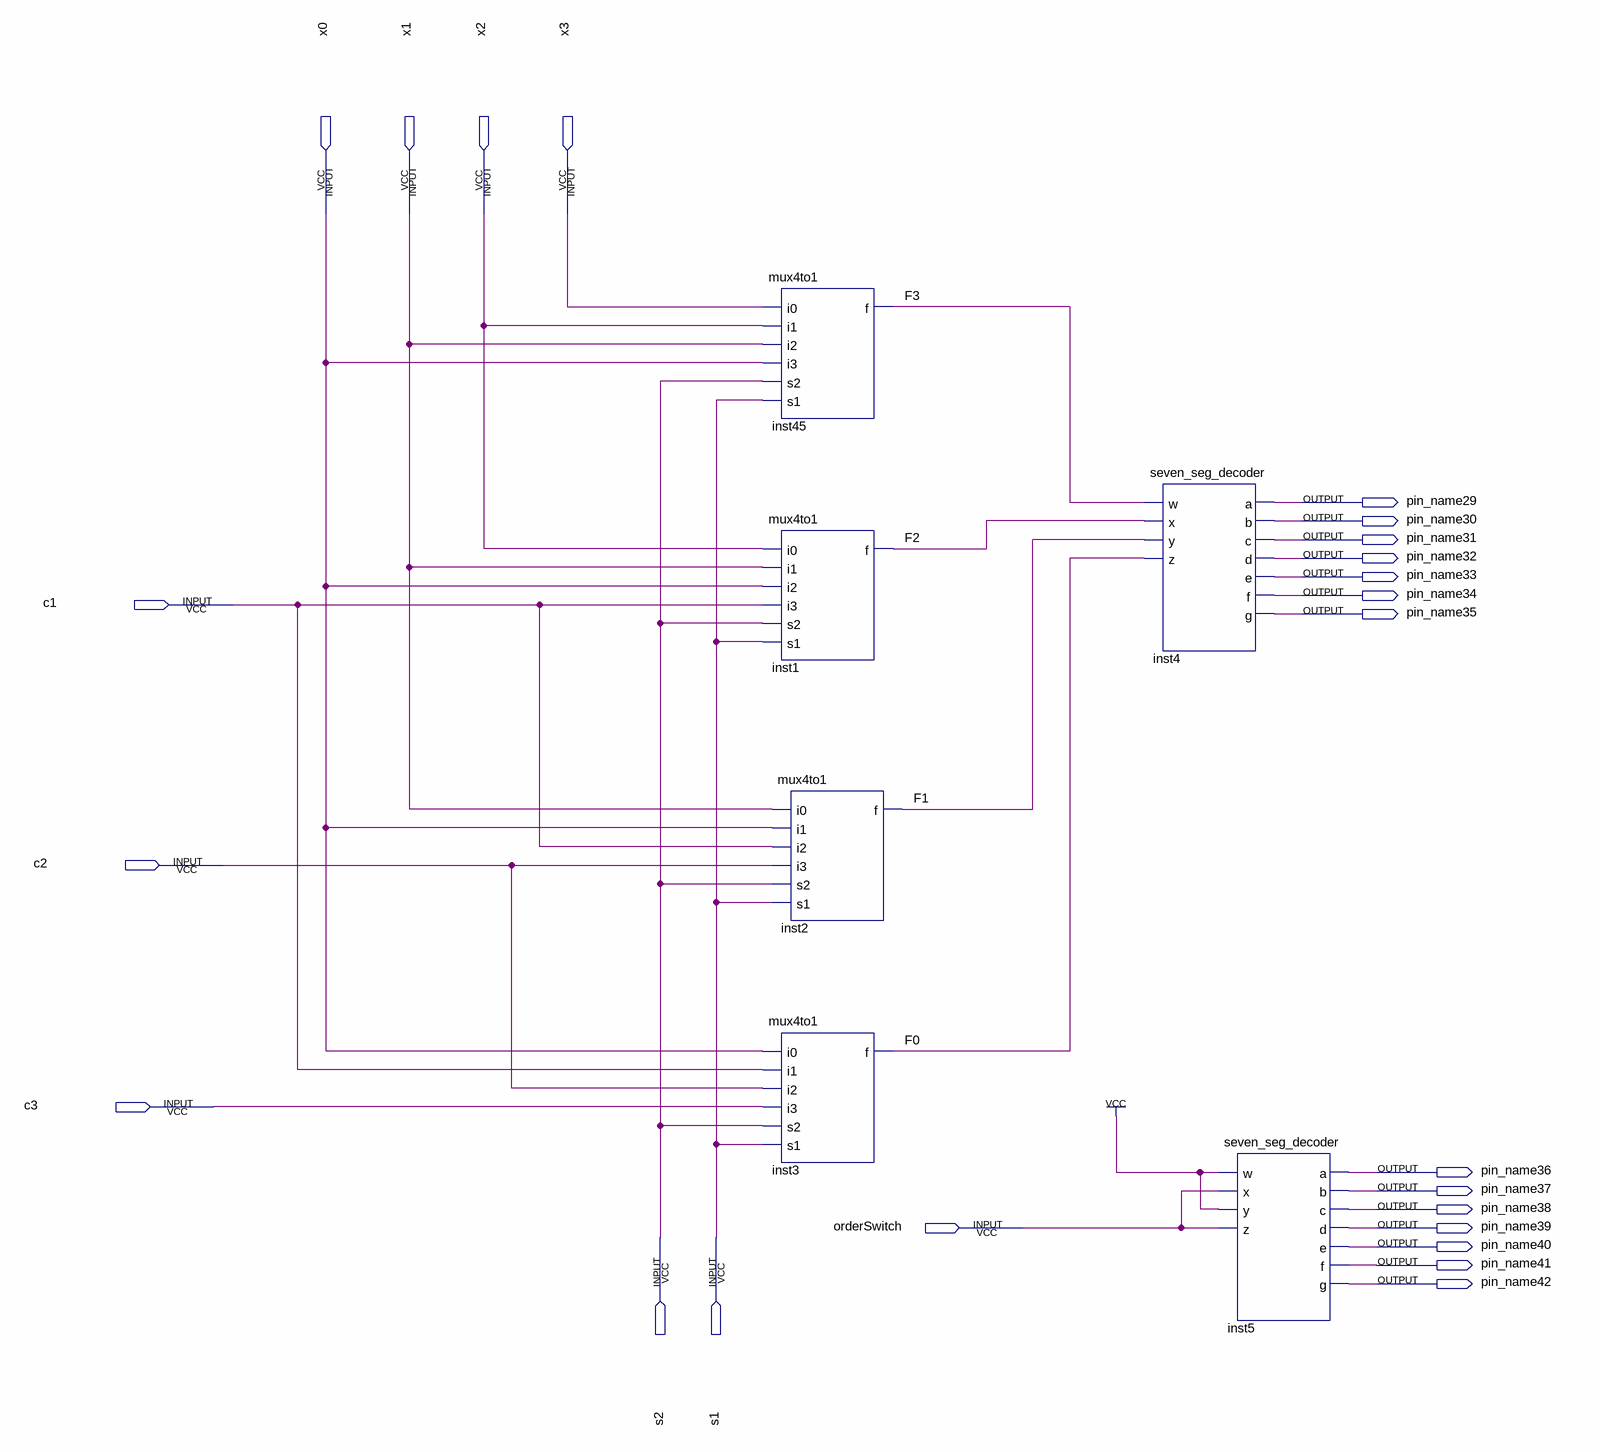
[diagram p0: schematic sheet]
// Quartus schematic inningRegister.bdf as structural Verilog: 6 symbols, 24 pins
module inningRegister (
  input  x0,
  input  x1,
  input  x2,
  input  x3,
  input  c1,
  input  c2,
  input  c3,
  input  orderSwitch,
  input  s2,
  input  s1,
  output pin_name29,
  output pin_name30,
  output pin_name31,
  output pin_name32,
  output pin_name33,
  output pin_name34,
  output pin_name35,
  output pin_name36,
  output pin_name37,
  output pin_name38,
  output pin_name39,
  output pin_name40,
  output pin_name41,
  output pin_name42
);

  wire F0, F1, F2, F3;

  mux4to1 inst45 (.i0(x3), .i1(x2), .i2(x1), .i3(x0), .s2(s2), .s1(s1), .f(F3));
  mux4to1 inst1 (.i0(x2), .i1(x1), .i2(x0), .i3(c1), .s2(s2), .s1(s1), .f(F2));
  mux4to1 inst2 (.i0(x1), .i1(x0), .i2(c1), .i3(c2), .s2(s2), .s1(s1), .f(F1));
  mux4to1 inst3 (.i0(x0), .i1(c1), .i2(c2), .i3(c3), .s2(s2), .s1(s1), .f(F0));
  seven_seg_decoder inst4 (
    .w(F3), .x(F2), .y(F1), .z(F0), .a(pin_name29), .b(pin_name30), .c(pin_name31), .d(pin_name32),
    .e(pin_name33), .f(pin_name34), .g(pin_name35));
  seven_seg_decoder inst5 (
    .w(1'b1), .x(orderSwitch), .y(1'b1), .z(orderSwitch), .a(pin_name36), .b(pin_name37), .c(pin_name38),
    .d(pin_name39), .e(pin_name40), .f(pin_name41), .g(pin_name42));
endmodule
